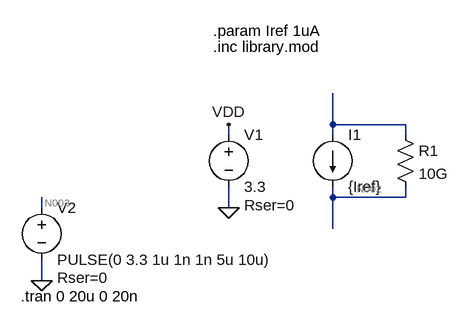
[diagram p0: schematic template.asc]
template.asc, the LTspice schematic file:
Version 4.1
SHEET 1 880 680
WIRE -176 128 -176 80
WIRE -64 128 -176 128
WIRE -336 144 -336 128
WIRE -176 144 -176 128
WIRE -64 144 -64 128
WIRE -176 240 -176 224
WIRE -64 240 -64 224
WIRE -64 240 -176 240
WIRE -624 256 -624 240
WIRE -336 256 -336 224
WIRE -176 288 -176 240
WIRE -624 368 -624 336
FLAG -336 256 0
FLAG -336 128 VDD
FLAG -624 368 0
SYMBOL current -176 144 R0
WINDOW 123 0 0 Left 0
WINDOW 39 0 0 Left 0
SYMATTR InstName I1
SYMATTR Value {Iref}
SYMBOL voltage -336 128 R0
WINDOW 123 0 0 Left 0
WINDOW 39 24 124 Left 2
SYMATTR SpiceLine Rser=0
SYMATTR InstName V1
SYMATTR Value 3.3
SYMBOL res -80 128 R0
SYMATTR InstName R1
SYMATTR Value 10G
SYMBOL voltage -624 240 R0
WINDOW 123 0 0 Left 0
WINDOW 39 24 124 Left 2
SYMATTR SpiceLine Rser=0
SYMATTR InstName V2
SYMATTR Value PULSE(0 3.3 1u 1n 1n 5u 10u)
TEXT -360 -16 Left 2 !.param Iref 1uA
TEXT -360 8 Left 2 !.inc library.mod
TEXT -656 392 Left 2 !.tran 0 20u 0 20n

The netlist it stands for:
* template.asc
I1 N001 N002 {Iref}
V1 VDD 0 3.3 Rser=0
R1 N001 N002 10G
V2 N003 0 PULSE(0 3.3 1u 1n 1n 5u 10u) Rser=0
.param Iref 1uA
.inc library.mod
.tran 0 20u 0 20n
.backanno
.end

* Results of the author's LTspice run, read from the files saved beside the schematic
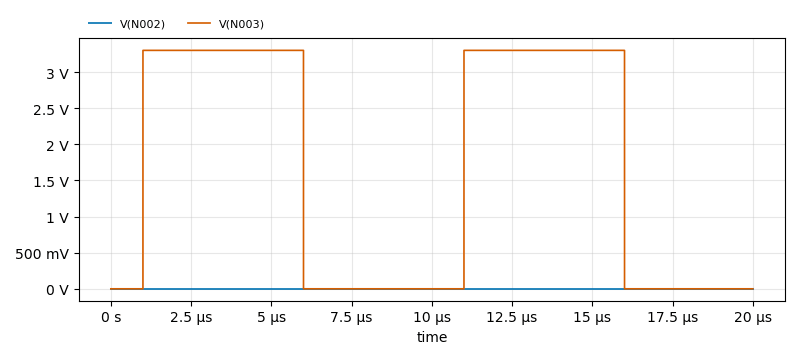
[diagram p1: Transient Analysis of template.asc, plotted from the saved traces]
* Transient Analysis, 1 run:
*   V(N002): min 0 V, max 121.9 pV, average 118.8 pV, rms 120.3 pV, last 121.9 pV
*   V(N003): min 0 V, max 3.3 V, average 1.65 V, rms 2.334 V, last 0 V